# Altium schematic sheet MicrobitQwiic 138.SchDoc: Complete design
size A4; DocumentNumber: 1; SheetNumber: 1; SheetTotal: 1; VersionControl_RevNumber: 1
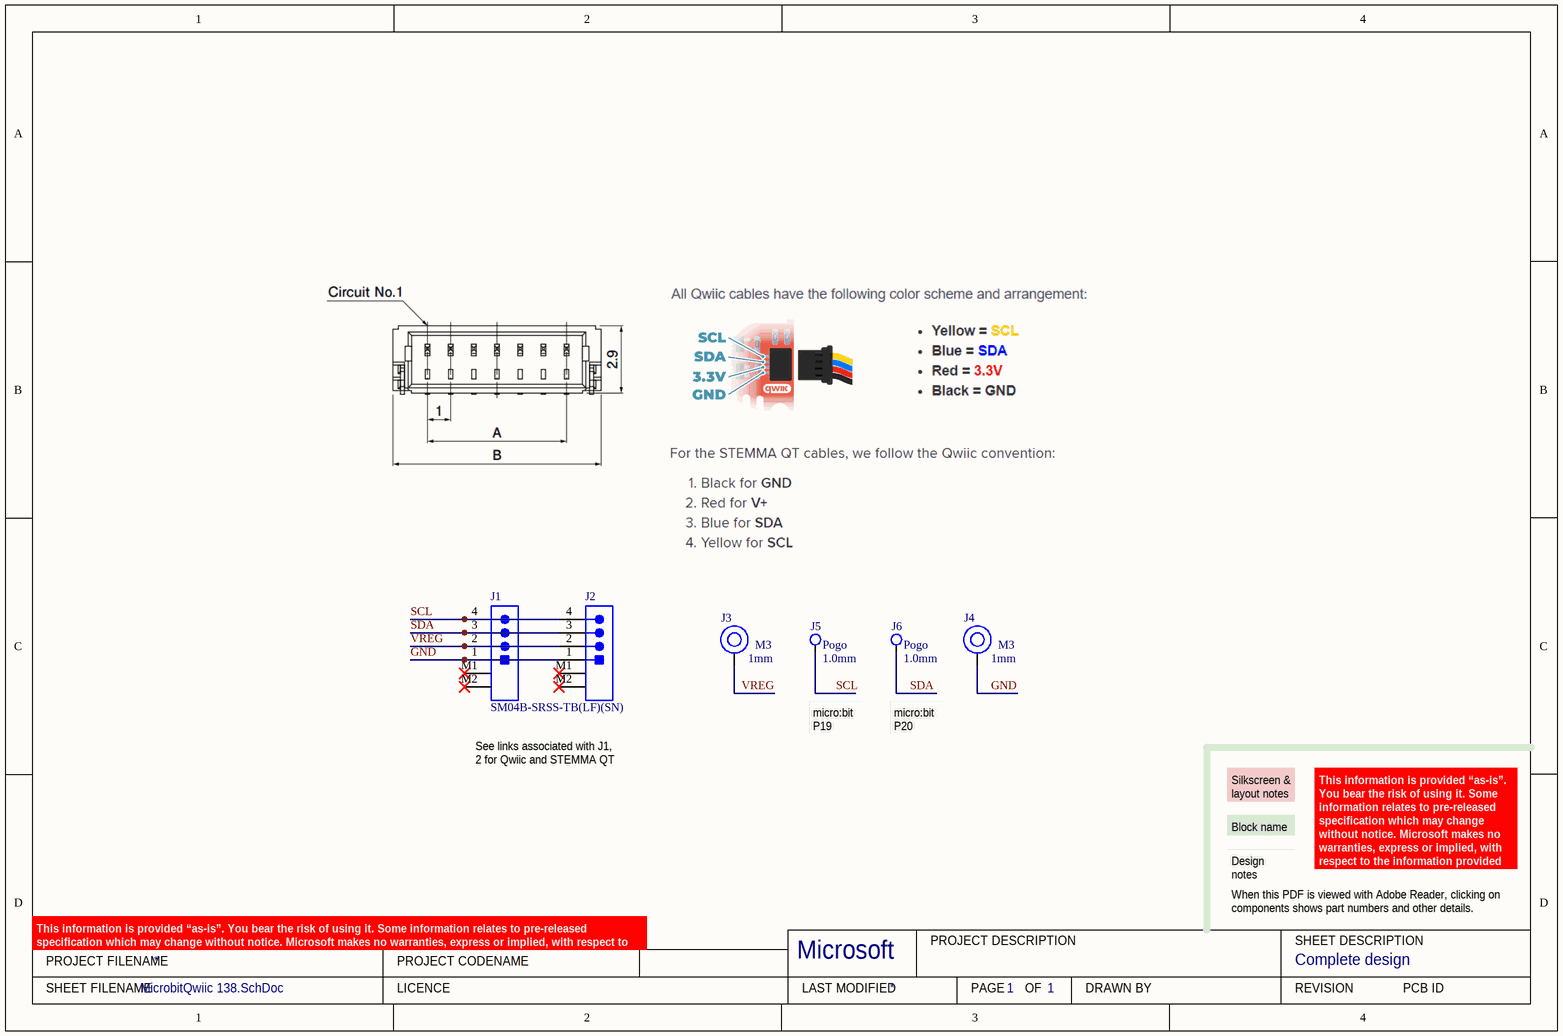
[diagram p0: MicrobitQwiic 138.SchDoc]

## Parts
J1  SM04B-SRSS-TB(LF)(SN)  [SM04B-SRSS-TB(LF)(SN)]
J2  SM04B-SRSS-TB(LF)(SN)  [SM04B-SRSS-TB(LF)(SN)]  (value not drawn)
J3  Standoff Height: 1mm  Diameter: M3  [smtso M3x1mm]  (hidden comment: SMTSO-M3-1mm)
J4  Standoff Height: 1mm  Diameter: M3  [smtso M3x1mm]  (hidden comment: SMTSO-M3-1mm)
J5  Pogo  Working Height: 1.0mm  [ALPS-SCTA2A0100]
J6  Pogo  Working Height: 1.0mm  [ALPS-SCTA2A0100]

## Nets
GND: J1.1(GND) J2.1(GND) J4.1
SCL: J1.4(SCL) J2.4(SCL) J5.1
SDA: J1.3(SDA) J2.3(SDA) J6.1
VREG: J1.2(VCC) J2.2(VCC) J3.1

Not connected (* = marked no-connect by the designer): J1 M1* M2*; J2 M1* M2*

## Notes on the sheet
- See links associated with J1, 2 for Qwiic and STEMMA QT info
- micro:bit P19
- micro:bit P20
- Block name
- Silkscreen & layout notes
- Design notes
- When this PDF is viewed with Adobe Reader, clicking on components shows part numbers and other details.
- This information is provided “as-is”. You bear the risk of using it. Some information relates to pre-released specification which may change without notice. Microsoft makes no warranties, express or implied, with respect to the information provided here.
- PROJECT FILENAME
- PROJECT CODENAME
- Microsoft
- PROJECT DESCRIPTION
- SHEET DESCRIPTION
- SHEET FILENAME
- LICENCE
- LAST MODIFIED
- PAGE
- OF
- DRAWN BY
- REVISION
- PCB ID

## Library data of the parts
J1 J2 = SM04B-SRSS-TB(LF)(SN): CONN HEADER SMD R/A 4POS 1MM; Manufacturer: JST; Number of Positions: 4; Connector Type: Male Pin; Contact Resistance: 40mR; Max Current Rating: 1A; Max Voltage Rating (AC): 50V; Pitch: 0.039inch; Supplier 1: Digi-Key; RoHS: Yes; Category: Connectors; Mount: Surface Mount; Contact Material: Copper Alloy; Contact Plating: Tin,Copper; Color: Natural; Housing Material: Polyamide; Housing Color: Beige; Min Operating Temperature: -25°C; Max Operating Temperature: 85°C; Number of Rows: 1; Termination: Solder; Packaging: Tape and Reel; Orientation: Right Angle; Number of Contacts: 4; Max Voltage Rating (DC): 50V; Length: 6mm; Depth: 4.95mm; Lead Free: Lead Free; ComponentLink1URL: https://datasheet.ciiva.com/26894/getdatasheetpartid-499363-26894945.pdf?src-supplier=Verical; ComponentLink1Description: Online datasheet; Supplier 2: Farnell; Supplier 3: Future Electronics; Supplier 4: Newark; Supplier Part Number 4: 87R0314; Supplier Part Number 3: 4517173; Supplier Part Number 2: 1830839; Supplier Part Number 1: 455-1804-1-ND; Manufacturer Part Number 1: SM04B-SRSS-TB(LF)(SN); Manufacturer 1: JST; ComponentLink2Description: STEMMA QT info; ComponentLink2URL: https://learn.adafruit.com/introducing-adafruit-stemma-qt/what-is-stemma-qt; ComponentLink3Description: Qwiic info; ComponentLink3URL: https://www.sparkfun.com/qwiic; Manufacturer Part Number: SM04B-SRSS-TB(LF)(SN)
J5 J6 = SCTA2A0100: PCB 3A Spring contct SMT 1.4x1.4x1.2mm, working height 0.8-1.2mm; Manufacturer 1: Alps Electric; ComponentLink3Description: Alps webpage; ComponentLink3URL: https://tech.alpsalpine.com/e/products/detail/SCTA2A0100/; Supplier 1: Farnell; Manufacturer Part Number 1: SCTA2A0100; RoHS: No; Category: Connectors; Stock 1: 6260; Pricing 1: 10=0.12200, 50=0.10400, 100=0.10100, 500=0.07680 (GBP); Supplier 2: Mouser; Supplier 3: LCSC; Supplier Part Number 3: C351180; Manufacturer: Alps Electric; Manufacturer Part Number: SCTA2A0100; Supplier Part Number 2: 688-SCTA2A0100; Supplier Part Number 1: 3261853
J3 J4 = SMTSO-M3-1mm: Supplier 1: LCSC; Supplier Part Number 1: C2916331